# EAGLE design outdoorac22 (EAGLE 8.6.3)
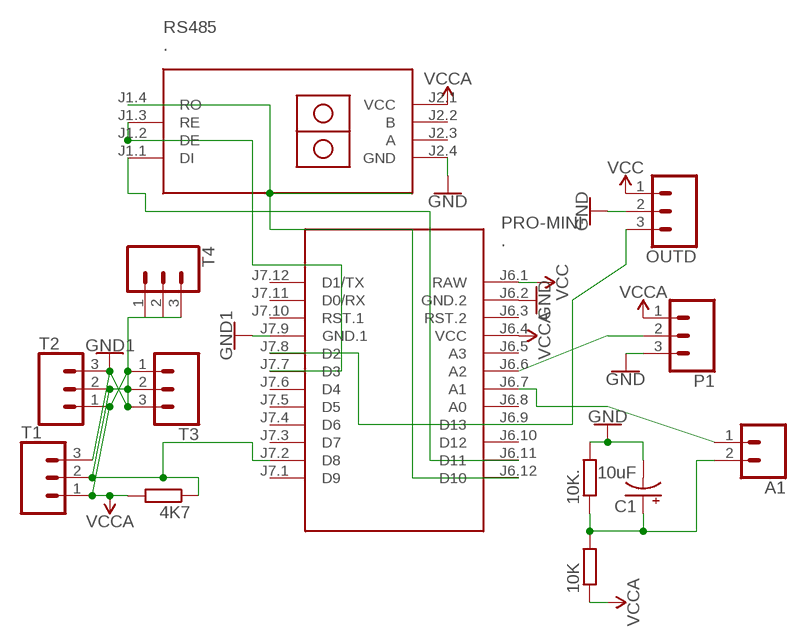
[diagram p0: schematic, sheet 1]

## Parts
4K7  R0204/7  [0204/7]
10K  R0204/7  [0204/7]
10K.  R0204/7  [0204/7]
A1  CONN_02  [1X02]
C1  10uF  10UF-POLAR-RADIAL-2.5MM-25V-20%  [CPOL-RADIAL-2.5MM-5MM]
OUTD  CONN_03-SCREW-5MM  [SCREWTERMINAL-5MM-3]
P1  CONN_03  [1X03]
PRO-MINI  .  ARDUINO-PRO-MINI-3.3V#SMP  [ARDUINO-PRO-MINI#SMP]
RS485  .  RS485-TTL-CONVERTER  [RS485-TTL-CONVERTER]
T1  CONN_03  [1X03]
T2  CONN_03  [1X03]
T3  CONN_03  [1X03]
T4  CONN_03  [1X03]

## Nets
GND: PRO-MINI.J7.9(GND.1) T1.3 T2.3 T3.3 T4.3 ; supply symbol labelled GND1
GND1: 10K..2 C1.2(-) OUTD.2 P1.3 PRO-MINI.J6.2(GND.2) RS485.J2.4(GND) ; supply symbol labelled GND
N$1: 4K7.1 PRO-MINI.J7.2(D8) T1.2 T2.2 T3.2 T4.2
N$2: A1.1 PRO-MINI.J6.7(A1)
N$3: P1.2 PRO-MINI.J6.6(A2)
N$4: 10K.2 10K..1 A1.2 C1.1(+)
N$5: PRO-MINI.J7.7(D3) RS485.J1.2(DE) RS485.J1.3(RE)
N$6: OUTD.3 PRO-MINI.J7.8(D2)
N$7: PRO-MINI.J6.11(D11) RS485.J1.1(DI)
N$8: PRO-MINI.J6.12(D10) RS485.J1.4(RO)
VCC: OUTD.1 PRO-MINI.J6.1(RAW)
VCCA: 4K7.2 10K.1 P1.1 PRO-MINI.J6.4(VCC) RS485.J2.1(VCC) T1.1 T2.1 T3.1 T4.1
Unconnected: PRO-MINI.J6.3(RST.2) PRO-MINI.J6.5(A3) PRO-MINI.J6.8(A0) PRO-MINI.J6.9(D13) PRO-MINI.J6.10(D12) PRO-MINI.J7.1(D9) PRO-MINI.J7.3(D7) PRO-MINI.J7.4(D6) PRO-MINI.J7.5(D5) PRO-MINI.J7.6(D4) PRO-MINI.J7.10(RST.1) PRO-MINI.J7.11(D0/RX) PRO-MINI.J7.12(D1/TX) RS485.J2.2(B) RS485.J2.3(A)

## Library data of the parts
4K7 10K 10K. = eagle-ltspice:R: RESISTOR, European symbol; SPICEMODEL: NONE; SPICEPREFIX: R
A1 = SparkFun-Connectors:CONN_02: Multi connection point. Often used as Generic Header-pin footprint for 0.1 inch spaced/style header connections On any of the 0.1 inch spaced packages, you can populate with these: Break Away Headers - Straight <https://www.sparkfun.com/products/116> (PRT-00116) Break Away Male Headers - Right Angle <https://www.sparkfun.com/products/553> (PRT-00553) Female Headers <https://www.sparkfun.com/products/115> (PRT-00115) Break Away Headers - Machine Pin <https://www.sparkfun.com/products/117> (PRT-00117) Break Away Female Headers - Swiss Machine Pin <https://www.sparkfun.com/products/743> (PRT-00743) For SCREWTERMINALS and SPRING TERMINALS visit here: Screw Terimnals on SparkFun.com <https://www.sparkfun.com/search/results?term=Screw+Terminals> (5mm/3.5mm/2.54mm spacing) This device is also useful as a general connection point to wire up your design to another part of your project. Our various solder wires solder well into these plated through hole pads. Hook-Up Wire - Assortment (Stranded, 22 AWG) <https://www.sparkfun.com/products/11375> (PRT-11375) Hook-Up Wire - Assortment (Solid Core, 22 AWG) <https://www.sparkfun.com/products/11367> (PRT-11367) View the entire wire category on our website here <https://www.sparkfun.com/categories/141> Special notes: Molex polarized connector foot print use with: PRT-08233 with associated crimp pins and housings. 2.54_SCREWTERM for use with PRT-10571. 3.5mm Screw Terminal footprints for PRT-08084 5mm Screw Terminal footprints for use with PRT-08432
C1 = SparkFun-Capacitors:10UF-POLAR: 10.0µF polarized capacitors A capacitor is a passive two-terminal electrical component used to store electrical energy temporarily in an electric field.; PROD_ID: CAP-08440
OUTD = SparkFun-Connectors:CONN_03: Multi connection point. Often used as Generic Header-pin footprint for 0.1 inch spaced/style header connections On any of the 0.1 inch spaced packages, you can populate with these: Break Away Headers - Straight <https://www.sparkfun.com/products/116> (PRT-00116) Break Away Male Headers - Right Angle <https://www.sparkfun.com/products/553> (PRT-00553) Female Headers <https://www.sparkfun.com/products/115> (PRT-00115) Break Away Headers - Machine Pin <https://www.sparkfun.com/products/117> (PRT-00117) Break Away Female Headers - Swiss Machine Pin <https://www.sparkfun.com/products/743> (PRT-00743) Stackable Header - 3 Pin (Female, 0.1") <https://www.sparkfun.com/products/13875> (PRT-13875) For SCREWTERMINALS and SPRING TERMINALS visit here: Screw Terimnals on SparkFun.com <https://www.sparkfun.com/search/results?term=Screw+Terminals> (5mm/3.5mm/2.54mm spacing) This device is also useful as a general connection point to wire up your design to another part of your project. Our various solder wires solder well into these plated through hole pads. Hook-Up Wire - Assortment (Stranded, 22 AWG) <https://www.sparkfun.com/products/11375> (PRT-11375) Hook-Up Wire - Assortment (Solid Core, 22 AWG) <https://www.sparkfun.com/products/11367> (PRT-11367) View the entire wire category on our website here <https://www.sparkfun.com/categories/141> Special notes: Molex polarized connector foot print use with SKU : PRT-08232 with associated crimp pins and housings.; PROD_ID: CONN-10134; SF_SKU: PRT-08433
P1 T1-T4 = SparkFun-Connectors:CONN_03: Multi connection point. Often used as Generic Header-pin footprint for 0.1 inch spaced/style header connections On any of the 0.1 inch spaced packages, you can populate with these: Break Away Headers - Straight <https://www.sparkfun.com/products/116> (PRT-00116) Break Away Male Headers - Right Angle <https://www.sparkfun.com/products/553> (PRT-00553) Female Headers <https://www.sparkfun.com/products/115> (PRT-00115) Break Away Headers - Machine Pin <https://www.sparkfun.com/products/117> (PRT-00117) Break Away Female Headers - Swiss Machine Pin <https://www.sparkfun.com/products/743> (PRT-00743) Stackable Header - 3 Pin (Female, 0.1") <https://www.sparkfun.com/products/13875> (PRT-13875) For SCREWTERMINALS and SPRING TERMINALS visit here: Screw Terimnals on SparkFun.com <https://www.sparkfun.com/search/results?term=Screw+Terminals> (5mm/3.5mm/2.54mm spacing) This device is also useful as a general connection point to wire up your design to another part of your project. Our various solder wires solder well into these plated through hole pads. Hook-Up Wire - Assortment (Stranded, 22 AWG) <https://www.sparkfun.com/products/11375> (PRT-11375) Hook-Up Wire - Assortment (Solid Core, 22 AWG) <https://www.sparkfun.com/products/11367> (PRT-11367) View the entire wire category on our website here <https://www.sparkfun.com/categories/141> Special notes: Molex polarized connector foot print use with SKU : PRT-08232 with associated crimp pins and housings.
PRO-MINI = diy-modules:ARDUINO-PRO-MINI-*#SMP: Arduino Pro Mini (and compatible devices) with 2 connectors only More details available here: https://www.arduino.cc/en/Main/ArduinoBoardProMini Click here to find device on ebay.com <http://www.ebay.com/sch/arduino+pro+mini>
RS485 = diy-modules:RS485-TTL-CONVERTER: RS485 to TTL converter based on MAX485 chip

## Board
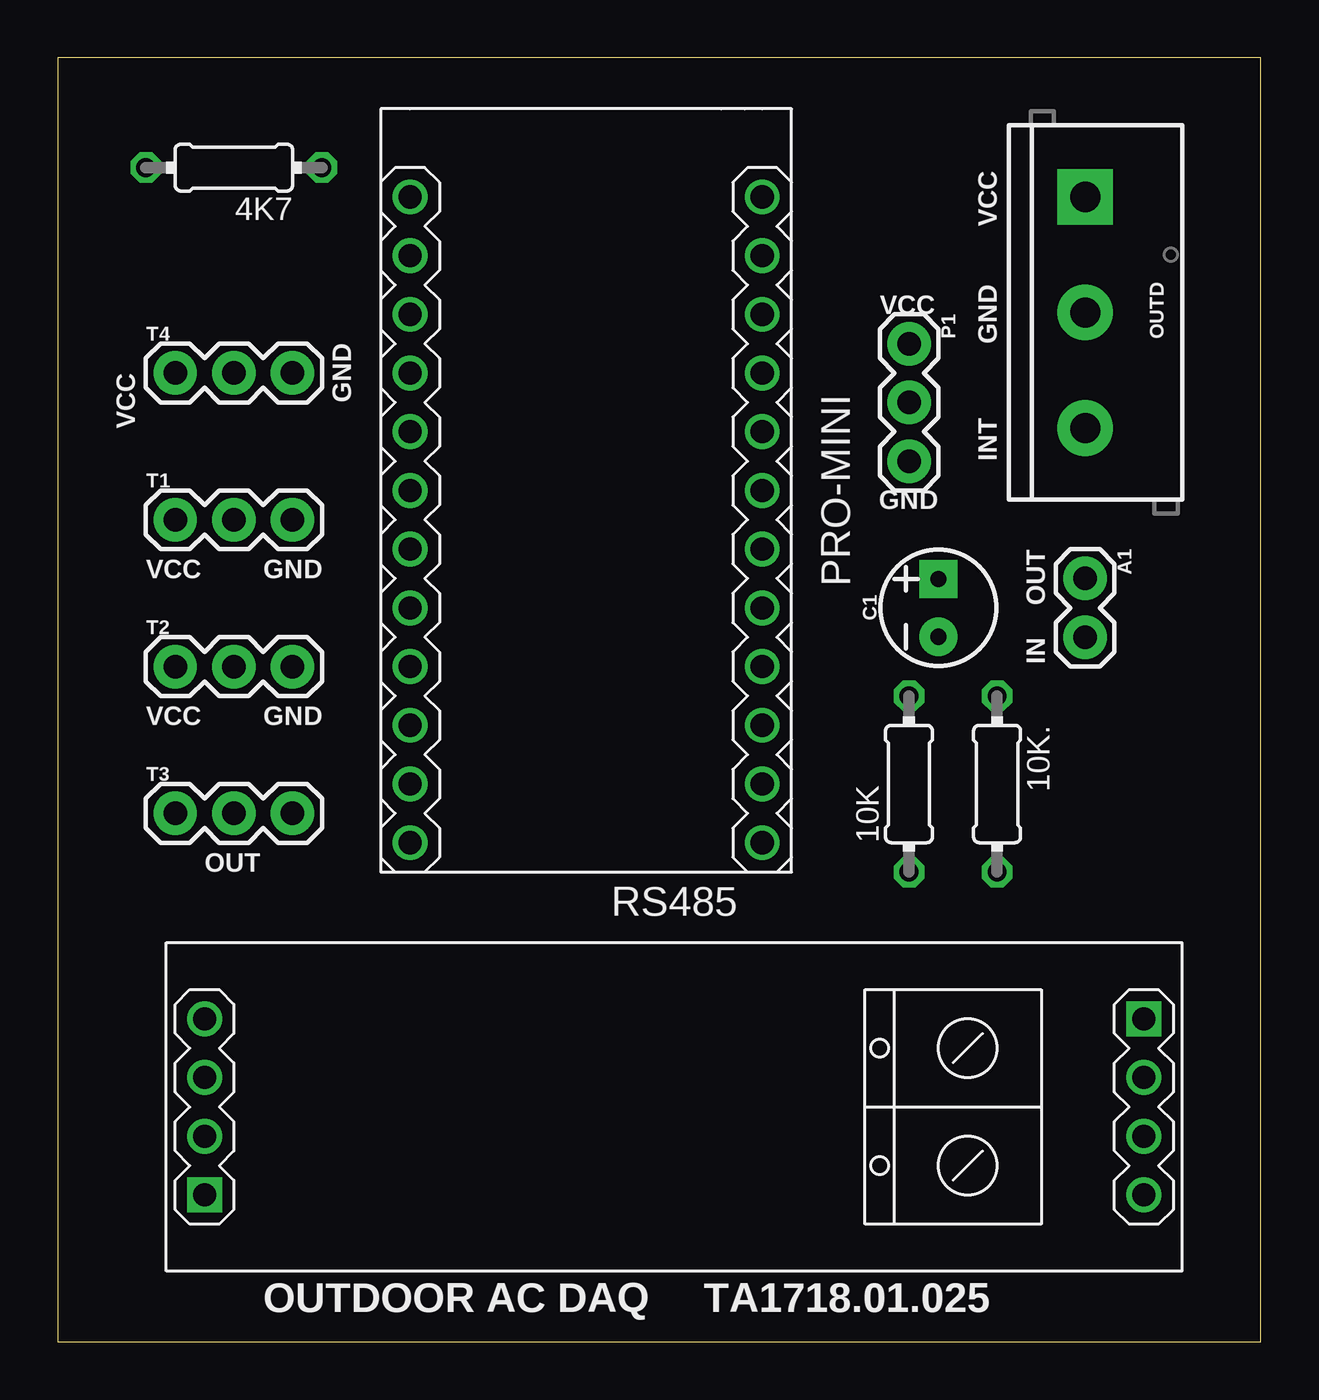
[diagram p1: board, top side]
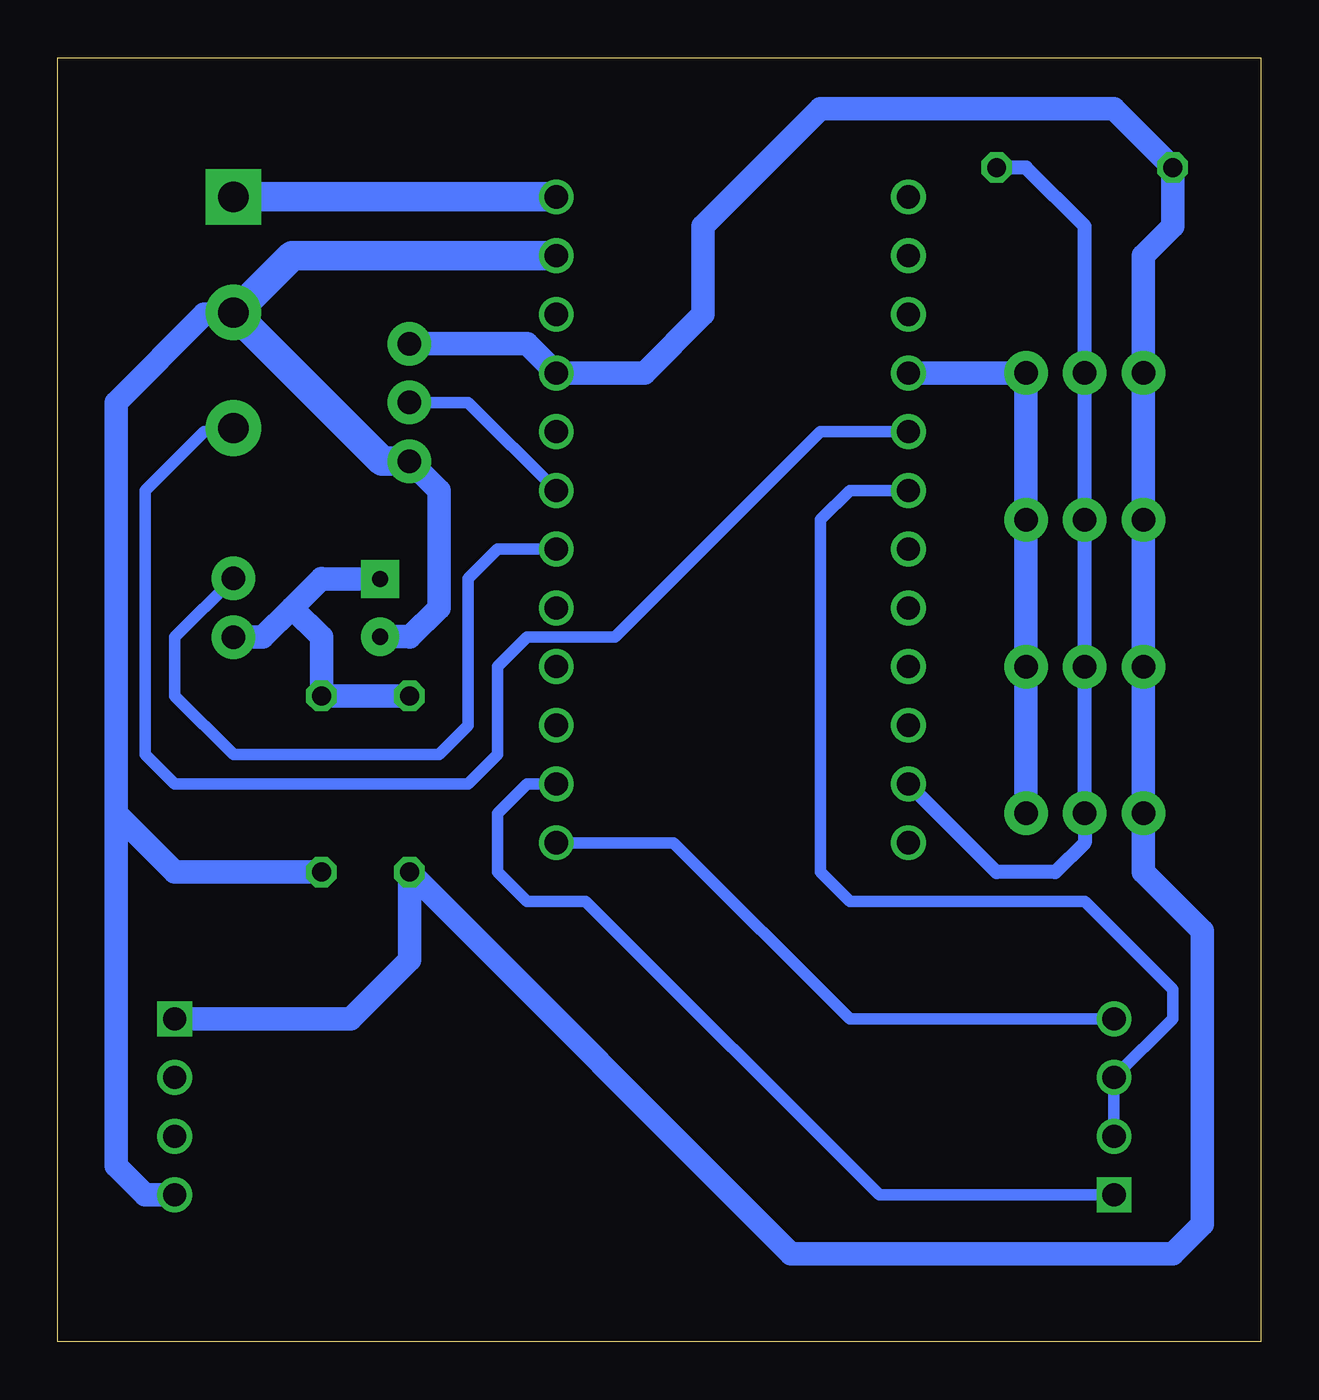
[diagram p2: board, bottom side, seen from below]

Size 52.05 x 55.55 mm. Coordinates in mm from the lower left corner, seen from the top.
Outline: 0,0 52.05,0 52.05,55.55 0,55.55 0,0
Copper layers (1*16): Top 0.035mm / dielectric 1.5mm / Bottom 0.035mm
Design rules "default": minimum track width 6mil, minimum drill 0.35mm, track to track 6mil, track to pad 6mil, pad to pad 6mil, via to via 6mil, smd to smd 6mil, copper to edge 40mil, drill to drill 6mil, minimum pad ring 10mil, minimum via ring 8mil, stop-mask expansion 4mil, vias tented up to drill 0mil, thermal gap 10mil

### Footprints (pad centres in the part's own frame; a part is rotated, then mirrored left to right if it is on the bottom)
0204/7 = drill 0.813 octagon: 1 -3.81,0; 2 3.81,0
1X02 = drill 1.016 pad 1.88: 1 0,0; 2 2.54,0
CPOL-RADIAL-2.5MM-5MM = drill 0.7 pad 1.651 square: 1 1.25,0 | drill 0.7 pad 1.651: 2 -1.25,0
SCREWTERMINAL-5MM-3 = drill 1.3 pad 2.413 square: 1 0,0 | drill 1.3 pad 2.413: 2 5,0; 3 10,0
1X03 = drill 1.016 pad 1.88: 1 0,0; 2 2.54,0; 3 5.08,0
ARDUINO-PRO-MINI#SMP = drill 1: J6.1 -12.7,7.62; J6.2 -10.16,7.62; J6.3 -7.62,7.62; J6.4 -5.08,7.62; J6.5 -2.54,7.62; J6.6 0,7.62; J6.7 2.54,7.62; J6.8 5.08,7.62; J6.9 7.62,7.62; J6.10 10.16,7.62; J6.11 12.7,7.62; J6.12 15.24,7.62; J7.1 15.24,-7.62; J7.2 12.7,-7.62; J7.3 10.16,-7.62; J7.4 7.62,-7.62; J7.5 5.08,-7.62; J7.6 2.54,-7.62; J7.7 0,-7.62; J7.8 -2.54,-7.62; J7.9 -5.08,-7.62; J7.10 -7.62,-7.62; J7.11 -10.16,-7.62; J7.12 -12.7,-7.62
RS485-TTL-CONVERTER = drill 1 square: J1.1 -20.32,-3.81; J2.1 20.32,3.81 | drill 1: J1.2 -20.32,-1.27; J1.3 -20.32,1.27; J1.4 -20.32,3.81; J2.2 20.32,1.27; J2.3 20.32,-1.27; J2.4 20.32,-3.81

### Placement (x,y rotation side)
4K7  7.62,50.8 180 top
10K  36.83,24.13 90 top
10K.  40.64,24.13 270 top
A1  44.45,33.02 270 top
C1  38.1,31.75 90 top
OUTD  44.45,49.53 270 top
P1  36.83,43.18 270 top
PRO-MINI  22.86,36.83 270 top
RS485  26.67,10.16 0 top
T1  5.08,35.56 0 top
T2  5.08,29.21 0 top
T3  5.08,22.86 0 top
T4  5.08,41.91 0 top

### Tracks (layer width: path | path; a pad name or v marks a point on that pad's centre or on a via)
GND
  Bottom 1.016: T3.3 T1.3 | T2.3 T1.3 | T1.3 T4.3 PRO-MINI.J7.9
GND1
  Bottom 1.016: 49.53,22.86 49.53,40.64 45.72,44.45 OUTD.2 | 10K..2 46.99,20.32 49.53,22.86 | RS485.J2.4 48.26,6.35 49.53,7.62 49.53,22.86 | P1.3 35.56,36.83 35.56,31.75 36.83,30.48 36.85,30.5 C1.2
  Bottom 1.27: PRO-MINI.J6.2 41.91,46.99 44.37,44.53 OUTD.2 38.02,38.1 P1.3
N$1
  Bottom 0.61: PRO-MINI.J7.2 11.43,20.32 8.89,20.32 7.62,21.59 T3.2 T2.2 T1.2 T4.2 7.62,48.26 10.16,50.8 4K7.1
N$2
  Bottom 0.508: A1.1 46.99,30.48 46.99,27.94 44.45,25.4 35.56,25.4 34.29,26.67 34.29,33.02 33.02,34.29 PRO-MINI.J6.7
N$3
  Bottom 0.508: P1.2 34.29,40.64 PRO-MINI.J6.6
N$4  (via drill 0.35)
  Top 0.508: v40.62,27.96 10K..1
  Bottom 1.016: 10K.2 40.6,27.94 v40.62,27.96 | C1.1 40.62,33 40.64,33.02 41.91,31.75 | 41.91,31.75 43.18,30.48 A1.2 | 10K..1 40.64,30.48 41.91,31.75
N$5
  Bottom 0.508: RS485.J1.2 RS485.J1.3 3.81,13.97 3.81,15.24 7.62,19.05 17.78,19.05 19.05,20.32 19.05,35.56 17.78,36.83 PRO-MINI.J7.7
N$6
  Bottom 0.508: OUTD.3 44.61,39.37 45.72,39.37 48.26,36.83 48.26,25.4 46.99,24.13 34.29,24.13 33.02,25.4 33.02,29.21 31.75,30.48 27.94,30.48 19.05,39.37 PRO-MINI.J7.8
N$7
  Bottom 0.508: PRO-MINI.J6.11 31.75,24.13 33.02,22.86 33.02,20.32 31.75,19.05 29.21,19.05 16.51,6.35 RS485.J1.1
N$8
  Bottom 0.508: PRO-MINI.J6.12 25.4,21.59 17.78,13.97 RS485.J1.4
VCC
  Bottom 1.27: OUTD.1 PRO-MINI.J6.1
VCCA
  Bottom 1.016: T1.1 T3.1 5.08,20.32 2.54,17.78 2.54,5.08 3.81,3.81 20.32,3.81 10K.1 36.83,16.51 39.37,13.97 RS485.J2.1 | T2.1 T1.1 | T1.1 T4.1 5.08,46.99 3.81,48.26 4K7.2 6.35,53.34 19.05,53.34 24.13,48.26 24.13,44.45 26.67,41.91 PRO-MINI.J6.4 31.75,43.18 P1.1

### Text on the board
tNames: VCC | VCC | GND | VCC | GND | INT | GND | OUT | VCC | GND | IN | VCC | GND | OUT | OUTDOOR AC DAQ | TA1718.01.025